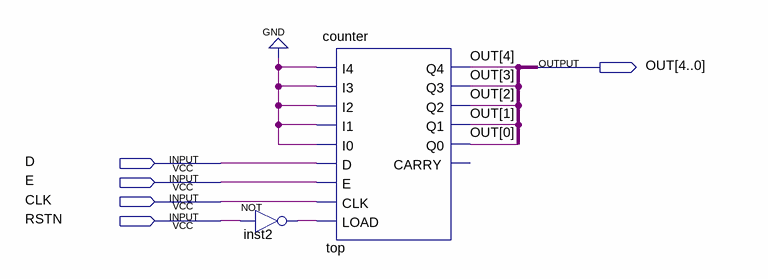
[diagram p0: schematic sheet]
// Quartus schematic TOP_ADDR.bdf as structural Verilog: 2 symbols, 5 pins
module TOP_ADDR (
  input  D,
  input  E,
  input  CLK,
  input  RSTN,
  output [4:0] OUT
);

  wire inst2_out;

  not inst2 (inst2_out, RSTN);
  counter top (
    .I4(1'b0), .I3(1'b0), .I2(1'b0), .I1(1'b0), .I0(1'b0), .D(D), .E(E), .CLK(CLK), .LOAD(inst2_out),
    .Q4(OUT[4]), .Q3(OUT[3]), .Q2(OUT[2]), .Q1(OUT[1]), .Q0(OUT[0]));  // open: CARRY
endmodule
